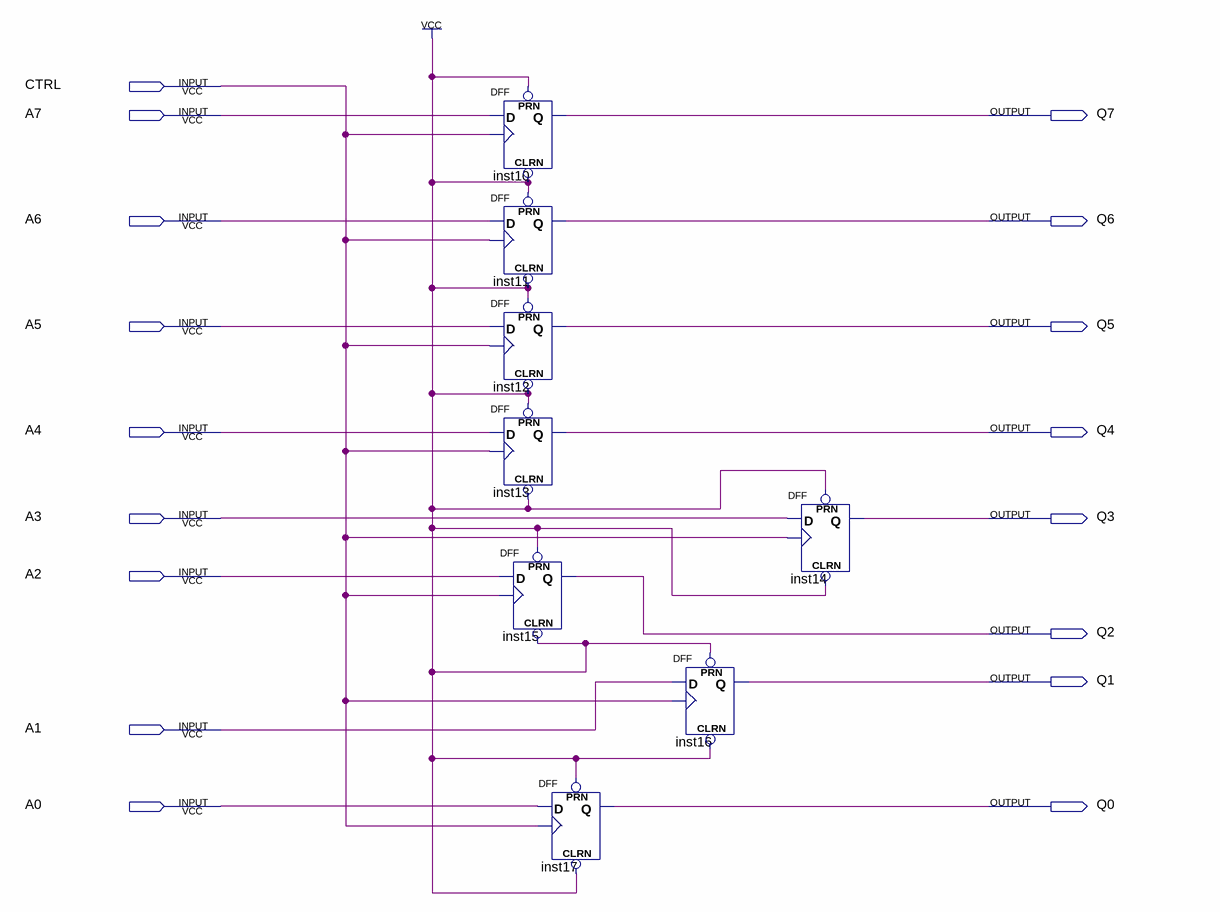
[diagram p0: schematic sheet]
// Quartus schematic REG2.bdf as structural Verilog: 8 symbols, 17 pins
module REG2 (
  input  CTRL,
  input  A7,
  input  A6,
  input  A5,
  input  A4,
  input  A3,
  input  A2,
  input  A1,
  input  A0,
  output Q7,
  output Q6,
  output Q5,
  output Q4,
  output Q3,
  output Q2,
  output Q1,
  output Q0
);

  DFF inst10 (.CLRN(1'b1), .CLK(CTRL), .D(A7), .PRN(1'b1), .Q(Q7));
  DFF inst11 (.CLRN(1'b1), .CLK(CTRL), .D(A6), .PRN(1'b1), .Q(Q6));
  DFF inst12 (.CLRN(1'b1), .CLK(CTRL), .D(A5), .PRN(1'b1), .Q(Q5));
  DFF inst13 (.CLRN(1'b1), .CLK(CTRL), .D(A4), .PRN(1'b1), .Q(Q4));
  DFF inst15 (.CLRN(1'b1), .CLK(CTRL), .D(A2), .PRN(1'b1), .Q(Q2));
  DFF inst17 (.CLRN(1'b1), .CLK(CTRL), .D(A0), .PRN(1'b1), .Q(Q0));
  DFF inst16 (.CLRN(1'b1), .CLK(CTRL), .D(A1), .PRN(1'b1), .Q(Q1));
  DFF inst14 (.CLRN(1'b1), .CLK(CTRL), .D(A3), .PRN(1'b1), .Q(Q3));
endmodule
